# Altium schematic sheet OSP_Carrier_V7_Release_PMIC_Audio.SchDoc: OSP Full Carrier Board
size B; DrawnBy: LP; Revision: 1; SheetNumber: 5; SheetTotal: 7
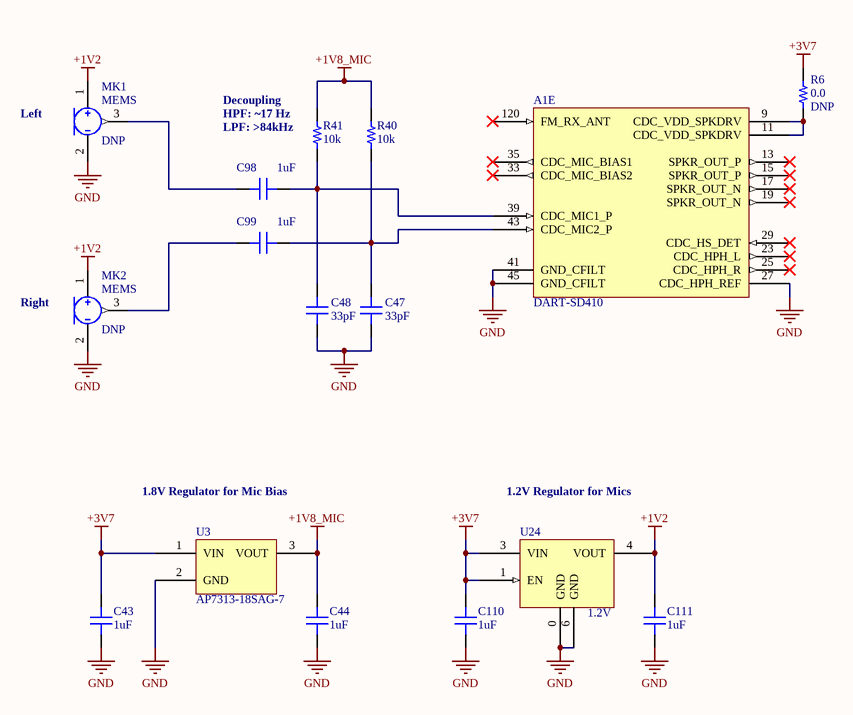
[diagram p0: OSP_Carrier_V7_Release_PMIC_Audio.SchDoc]

## Parts
A1  DART-SD410  [DART-SD410]  (part E of 15)
C43  1uF  [CAP 0402/1005]
C44  1uF  [CAP 0402/1005]
C47  33pF  [CAP 0402/1005]
C48  33pF  [CAP 0402/1005]
C98  1uF  [CAP 0603/1608]
C99  1uF  [CAP 0603/1608]
C110  1uF  [CAP 0402/1005]
C111  1uF  [CAP 0402/1005]
MK1  MEMS  [MEMS_MIC]
MK2  MEMS  [MEMS_MIC]
R6  0.0  [RES 0603/1608]
R40  10k  [RES 0402/1005]
R41  10k  [RES 0402/1005]
U3  AP7313-18SAG-7  [DIODES SOT-23-3]
U24  1.2V  [MICROCHIP_MIC5512]

## Nets
+1V2: C111.1 MK1.1(VDD) MK2.1(VDD) U24.4(VOUT)
+1V8_MIC: C44.1 R40.2 R41.2 U3.3(VOUT)
+3V7: C43.1 C110.1 R6.2 U3.1(VIN) U24.1(EN) U24.3(VIN)
GND: A1.27(CDC_HPH_REF) A1.41(GND_CFILT) A1.45(GND_CFILT) C43.2 C44.2 C47.1 C48.1 C110.2 C111.2 MK1.2(GND) MK2.2(GND) U3.2(GND) U24.0(GND) U24.6(GND)
NetA1_9: A1.9(CDC_VDD_SPKDRV) A1.11(CDC_VDD_SPKDRV) R6.1
NetA1_39: A1.39(CDC_MIC1_P) C48.2 C98.1 R41.1
NetA1_43: A1.43(CDC_MIC2_P) C47.2 C99.1 R40.1
NetC98_2: C98.2 MK1.3
NetC99_2: C99.2 MK2.3

Not connected (* = marked no-connect by the designer): A1 13(SPKR_OUT_P)* 15(SPKR_OUT_P)* 17(SPKR_OUT_N)* 19(SPKR_OUT_N)* 23(CDC_HPH_L)* 25(CDC_HPH_R)* 29(CDC_HS_DET)* 33(CDC_MIC_BIAS2)* 35(CDC_MIC_BIAS1)* 120(FM_RX_ANT)*

## Notes on the sheet
- (near MK1) Left
- (near R41) Decoupling
- (near R41) HPF: ~17 Hz
- (near R41) LPF: >84kHz
- (near MK2) Right
- 1.8V Regulator for Mic Bias
- 1.2V Regulator for Mics
- Title
- Size:
- Date:
- B
- Revision:
- Time:
- Drawn By:
- Approved:
- Sheet
- of
- LACI
- Atkinson Hall, 5202
- UC San Diego
- 9500 Gilman Drive #0436
- La Jolla, CA 92093-0436
- File:

## Library data of the parts
A1 = DART-SD410: Variscite DART-SD410 System on Module
C43 C44 C110 C111 = GRM155R61A105KE15D: CAP CER 1UF 10V X5R 0402; Manufacturer: Murata Electronics North America; TemperatureRange: -55C ~ 85C; Tolerance: 10%; Value: 1uF; Part Number: GRM155R61A105KE15D; PartId: 12338; Supplier 1: Digi-Key; Supplier Part Number 1: 490-3890-2-ND; ComponentLink1Description: Datasheet; ComponentLink1URL: http://www.murata.com/~/media/webrenewal/support/library/catalog/products/capacitor/mlcc/c02e.pdf; ComponentLink2Description: Digi-Key Listing; ComponentLink2URL: https://www.digikey.com/product-detail/en/murata-electronics-north-america/GRM155R61A105KE15D/490-3890-2-ND/965904; TemperatureCoefficient: X5R; Voltage: 10V; Price: 0.0069; Device Package: 0402 (1005 Metric)
C47 C48 = C1005C0G1H330J050BA: CAP CER 33PF 50V C0G 0402; Manufacturer: TDK Corporation; TemperatureRange: -55C ~ 125C; TemperatureCoefficient: C0G, NP0; Tolerance: 5%; Value: 33pF; Part Number: C1005C0G1H330J050BA; PartId: 3877; Supplier 1: Digi-Key; Supplier Part Number 1: 445-1241-2-ND; ComponentLink1Description: Datasheet; ComponentLink1URL: https://product.tdk.com/info/en/catalog/datasheets/mlcc_commercial_general_en.pdf; ComponentLink2Description: Digi-Key listing; ComponentLink2URL: http://digikey.com/product-detail/en/C1005C0G1H330J050BA/445-1241-2-ND/513687; Voltage: 50V; Price: 0.006; Type: -; Device Package: 0402 (1005 Metric)
C98 C99 = C1608X7R1E105K080AB: CAP CER 1UF 25V X7R 0603; Manufacturer: TDK Corporation; TemperatureRange: -55C ~ 125C; Tolerance: 10%; Value: 1uF; Part Number: C1608X7R1E105K080AB; PartId: 4041; Supplier 1: Digi-Key; Supplier Part Number 1: 445-5956-1-ND; ComponentLink1Description: Datasheet; ComponentLink1URL: https://product.tdk.com/info/en/catalog/datasheets/mlcc_commercial_general_en.pdf; ComponentLink2Description: Digi-Key listing; ComponentLink2URL: http://digikey.com/product-detail/en/C1608X7R1E105K080AB/445-5956-1-ND/2443997; TemperatureCoefficient: X7R; Voltage: 25V; Price: 0.27; Type: -; Device Package: 0603 (1608 Metric)
MK1 MK2 = Mems_Mic: Generic 3-pin bottom mount MEMS mic; DNP: DNP
R6 = CRCW06030000Z0EAHP: RES SMD 0.0 OHM JUMPER 1/4W 0603; Manufacturer: Vishay Dale; TemperatureRange: -55C ~ 155C; PowerRating: 0.25W, 1/4W; Value: 0.0; Part Number: CRCW06030000Z0EAHP; PartId: 16113; Supplier 1: Digi-Key; Supplier Part Number 1: 541-0.0SBTR-ND; ComponentLink1Description: Datasheet; ComponentLink1URL: http://www.vishay.com/docs/20043/crcwhpe3.pdf; ComponentLink2Description: Digi-Key Listing; ComponentLink2URL: https://www.digikey.com/product-detail/en/vishay-dale/CRCW06030000Z0EAHP/541-0.0SBTR-ND/2222231; Tolerance: Jumper; Price: 0.0238; Device Package: 0603 (1608 Metric); DNP: DNP
R40 R41 = ERJ-2RKF1002X: RES SMD 10K OHM 1% 1/10W 0402; Manufacturer: Panasonic Electronic Components; TemperatureRange: -55C ~ 155C; TemperatureCoefficient: 100ppm/C; PowerRating: 0.1W, 1/10W; Value: 10k; Part Number: ERJ-2RKF1002X; PartId: 1; Supplier 1: Digi-Key; Supplier Part Number 1: P10.0KLTR-ND; ComponentLink1Description: Datasheet; ComponentLink1URL: http://industrial.panasonic.com/www-cgi/jvcr13pz.cgi?E+PZ+3+AOA0002+ERJ2RKF1002X+7+WW; ComponentLink2Description: Digikey listing; ComponentLink2URL: http://digikey.com/product-detail/en/ERJ-2RKF1002X/P10.0KLTR-ND/192073; Tolerance: 1%; Price: 0.0043; Type: Thick Film; Device Package: 0402 (1005 Metric)
U3 = AP7313-18SAG-7: IC REG LDO 1.8V 0.15A SOT23-3; Manufacturer: Diodes Incorporated; Topology: Positive Fixed; Voltage - Input: 2 V ~ 6 V; Current - Limit (Min): 200mA; Part Number: AP7313-18SAG-7; PartId: 7912; Supplier 1: Digi-Key; Supplier Part Number 1: AP7313-18SAG-7DITR-ND; ComponentLink1Description: Datasheet; ComponentLink1URL: http://www.diodes.com/_files/datasheets/AP7313.pdf; ComponentLink2Description: Digi-Key Listing; ComponentLink2URL: http://www.digikey.ca/product-detail/en/AP7313-18SAG-7/AP7313-18SAG-7DITR-ND/2270804; Price: 0.1675; Device Package: TO-236-3, SC-59, SOT-23-3; Voltage - Output: 1.8V; Voltage Dropout: -; Operating Temperature: -40C ~ 85C
U24 = Microchip_MIC5512-1.2YMT: Microchip MIC5512-1.2YMT 1.2V 300mA linear regulator